# Altium schematic sheet Sensores.SchDoc: Sensores
size A4; CheckedBy: Mario de Miguel; DrawnBy: Alberte Gil; SheetNumber: 5; SheetTotal: 5
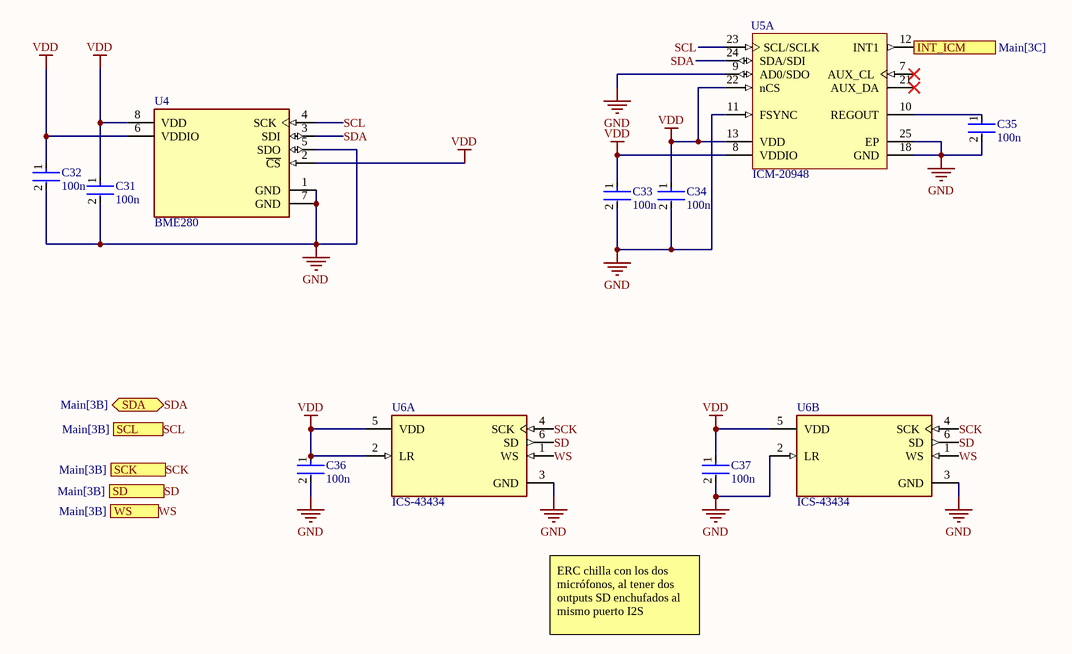
[diagram p0: Sensores.SchDoc]

## Parts
C31  100n  [FP-GRM033-0_03-MFG]
C32  100n  [FP-GRM033-0_03-MFG]
C33  100n  [FP-GRM033-0_03-MFG]
C34  100n  [FP-GRM033-0_03-MFG]
C35  100n  [FP-GRM033-0_03-MFG]
C36  100n  [FP-GRM033-0_03-MFG]
C37  100n  [FP-GRM033-0_03-MFG]
U4  BME280  [FP-BME280-MFG]
U5  ICM-20948  [TDK-QFN-24_L]  (part A of 2)
U6A  ICS-43434  [FP-ICS-43434-MFG]
U6B  ICS-43434  [FP-ICS-43434-MFG]

## Ports
INT_ICM (out, see Main[3C]), SCK (in, see Main[3B]), SCL (in, see Main[3B]), SD (out, see Main[3B]), SDA (bidir, see Main[3B]), WS (in, see Main[3B])

## Nets
GND: C31.2 C32.2 C33.2 C34.2 C35.2 C36.2 C37.2 U4.1(GND) U4.5(SDO) U4.7(GND) U5.9(AD0/SDO) U5.11(FSYNC) U5.18(GND) U5.25(EP) U6A.3(GND) U6B.2(LR) U6B.3(GND)
VDD: C31.1 C32.1 C33.1 C34.1 C36.1 C37.1 U4.2(~{CS}) U4.6(VDDIO) U4.8(VDD) U5.8(VDDIO) U5.13(VDD) U5.22(nCS) U6A.2(LR) U6A.5(VDD) U6B.5(VDD)
INT_ICM: U5.12(INT1) ; port INT_ICM
SCK: U6A.4(SCK) U6B.4(SCK) ; port SCK
SCL: U4.4(SCK) U5.23(SCL/SCLK) ; port SCL
SD: U6A.6(SD) U6B.6(SD) ; port SD
SDA: U4.3(SDI) U5.24(SDA/SDI) ; port SDA
WS: U6A.1(WS) U6B.1(WS) ; port WS
NetC35_1: C35.1 U5.10(REGOUT)

Not connected (* = marked no-connect by the designer): U5 7(AUX_CL)* 21(AUX_DA)*

## Notes on the sheet
- ERC chilla con los dos micrófonos, al tener dos outputs SD enchufados al mismo puerto I2S
- Title:
- Drawn By:
- Page Contents:
- Checked By:
- Size:
- Date:
- File:
- License:
- Email:
- A4
- Number:
- Time:
- Revision:
- Sheet
- Website:
- of

## Library data of the parts
C31-C37 = CMP-06035-019037-1: Chip Multilayer Ceramic Capacitors for General Purpose, 0201, 0.10uF, X7S, 22%, 10%, 16V; Capacitance: 100nF; Dielectric: X7S; Tolerance: 10%; Voltage Rating (DC): 16V; Height: 0.3mm; Max Operating Temperature: 125°C; Case Code (Metric): 0603; Termination: SMD/SMT; Min Operating Temperature: -55°C; Mount: Surface Mount; Case/Package: 0201; Weight: 1.2E-05oz; Package Quantity: 15000; Length: 0.024inch; Voltage Rating: 16V; Case Code (Imperial): 0201; Packaging: Tape and Reel; Thickness: 0.013inch; Width: 0.3mm
U4 = CMP-2000-05073-3: SENSOR PRESSURE HUMIDITY TEMP; Sensor Type: Temperature; Accuracy: 3%; Response Time: 1s; Output Type: SPI; Min Operating Temperature: -40°C; Max Operating Temperature: 85°C; Case/Package: LGA; Packaging: Cut Tape; Mount: Surface Mount; Lead Free: Lead Free; Number of Pins: 8
U5 = CMP-2000-07532-1: World’s Lowest Power 9-Axis MEMS MotionTracking(TM) Device, 1.71 to 3.6 V, -40 to 85 degC, 24-Pin QFN, RoHS, Tape and Reel; Manufacturer: TDK; Package Description: 24-Pin Quad Flat No-lead Package, Body 3 x 3 mm, Pitch 0.4 mm; Datasheet Version: Rev. 1.3, 06/2017; Package Reference: QFN-24; Mounting Technology: SurfaceMount; Datasheet URL: https://www.invensense.com/wp-content/uploads/2016/06/DS-000189-ICM-20948-v1.3.pdf; Manufacturer URL: http://www.tdk.com/
U6A U6B = CMP-03292-71346757-1: ICS-43434 Mic Omni-Directional -26dB 3.63V Rectangular Solder Pad T/R; Min Supply Voltage: 1.65V; Direction: Omnidirectional; Operating Supply Current: 550µA; Output Type: Digital; Max Operating Temperature: 85°C; Max Length: 3.6mm; NexarPartId: 71346757; RoHS: Compliant; Width: 2.65mm; Min Operating Temperature: -40°C; Max Supply Voltage: 3.63V; Min Length: 3.4mm; Length: 3.5mm; Min Thickness: 880µm; Lifecycle Status: Production; Min Width: 2.55mm; Max Thickness: 1.08mm; Max Width: 2.75mm; Schedule B: 8518100000; Height: 980µm